# EAGLE design ATmega32 breakout board (EAGLE 6.4)
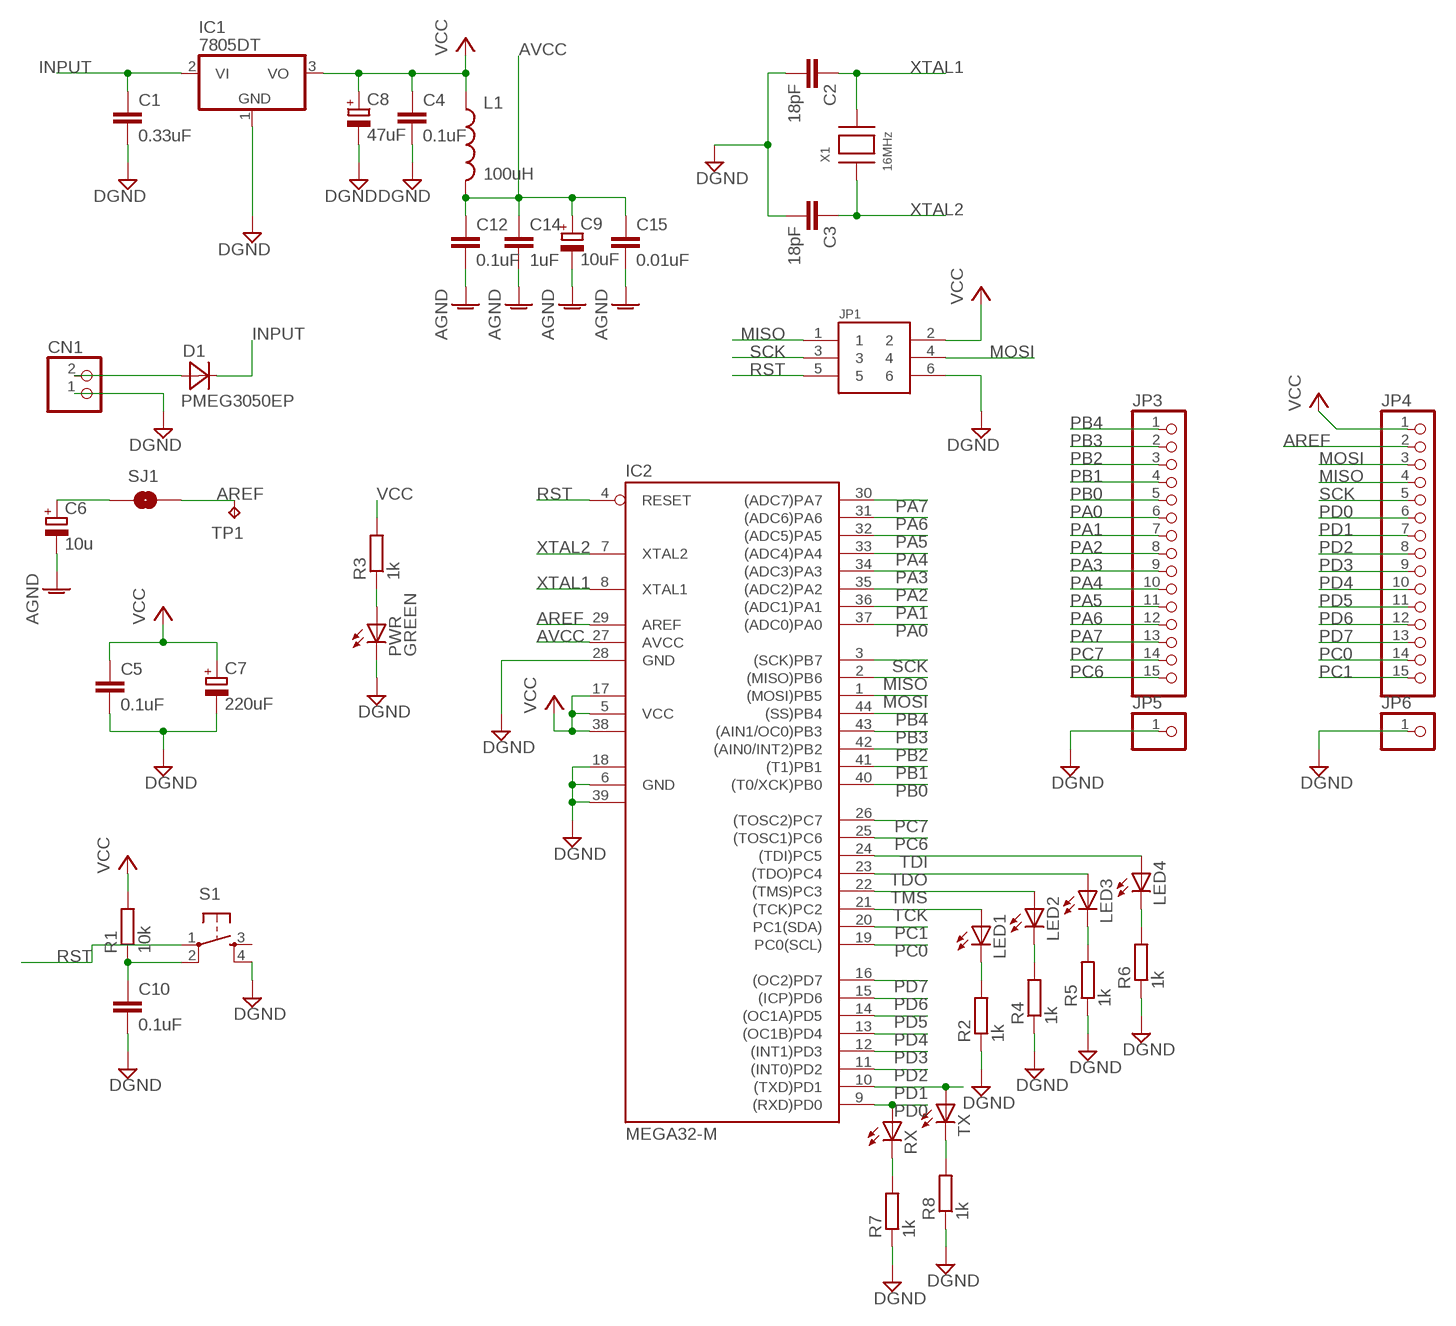
[diagram p0: schematic, sheet 1]

## Parts
C1  0.33uF  C-EUC0603  [C0603]
C2  18pF  C-EUC0603  [C0603]
C3  18pF  C-EUC0603  [C0603]
C4  0.1uF  C-EUC0603  [C0603]
C5  0.1uF  C-EUC0603  [C0603]
C6  10u  CPOL-EUA  [PANASONIC_A]
C7  220uF  CPOL-EUE2.5-5  [E2,5-5]
C8  47uF  CPOL-EUE2.5-5  [E2,5-5]
C9  10uF  CPOL-EUE2-4  [E2-4]
C10  0.1uF  C-EUC0603  [C0603]
C12  0.1uF  C-EUC0603  [C0603]
C14  1uF  C-EUC0603  [C0603]
C15  0.01uF  C-EUC0603  [C0603]
CN1  JST_2PIN-THM-RA  [JST-PH-2-THM-RA]
D1  PMEG3050EP  MBRA340T3  [SMA]
IC1  7805DT  [TO252]
IC2  MEGA32-M  [MLF44]
JP1  M03X2  [2X3-SHROUDED]
JP3  PINHD-1X15-CB  [1X15-CB]
JP4  PINHD-1X15-CB  [1X15-CB]
JP5  PINHD-1X1CB  [1X01-CLEANBIG]
JP6  PINHD-1X1CB  [1X01-CLEANBIG]
L1  100uH  INDUCTOR0805  [0805]
LED1  LEDCHIPLED_0603  [CHIPLED_0603]
LED2  LEDCHIPLED_0603  [CHIPLED_0603]
LED3  LEDCHIPLED_0603  [CHIPLED_0603]
LED4  LEDCHIPLED_0603  [CHIPLED_0603]
PWR  GREEN  LEDCHIPLED_0805  [CHIPLED_0805]
R1  10k  R-EU_R0603  [R0603]
R2  1k  R-EU_R0402  [R0402]
R3  1k  R-EU_R0603  [R0603]
R4  1k  R-EU_R0402  [R0402]
R5  1k  R-EU_R0402  [R0402]
R6  1k  R-EU_R0402  [R0402]
R7  1k  R-EU_R0402  [R0402]
R8  1k  R-EU_R0402  [R0402]
RX  LEDCHIPLED_0603  [CHIPLED_0603]
S1  TAC_SWITCHSMD  [TACTILE_SWITCH_SMD]
SJ1  SOLDERJUMPER-OLDTRACE  [SJ_2S-TRACE]
TP1  TPTP10R  [TP10R]
TX  LEDCHIPLED_0603  [CHIPLED_0603]
X1  16MHz  XTALNX5032  [NX5032]

## Nets
AGND: C6.- C9.- C12.2 C14.2 C15.2
AREF: IC2.29(AREF) JP4.2 SJ1.2 TP1.TP
AVCC: C9.+ C12.1 C14.1 C15.1 IC2.27(AVCC) L1.2
GND: C1.2 C2.2 C3.2 C4.2 C5.2 C7.- C8.- C10.2 CN1.1 IC1.1(GND) IC2.6(GND) IC2.18(GND1) IC2.28(GND) IC2.39(GND2) JP1.6 JP5.1 JP6.1 PWR.C R2.1 R4.1 R5.1 R6.1 R7.1 R8.1 S1.4 ; supply symbol labelled DGND
INPUT: C1.1 D1.C IC1.2(VI)
MISO: IC2.2((MISO)PB6) JP1.1 JP4.4
MOSI: IC2.1((MOSI)PB5) JP1.4 JP4.3
N$1: PWR.A R3.1
N$2: C10.1 R1.1 S1.2
N$3: CN1.2 D1.A
N$4: LED1.C R2.2
N$5: C6.+ SJ1.1
N$6: LED2.C R4.2
N$7: LED3.C R5.2
N$8: LED4.C R6.2
N$9: R7.2 RX.C
N$10: R8.2 TX.C
PA0: IC2.37((ADC0)PA0) JP3.6
PA1: IC2.36((ADC1)PA1) JP3.7
PA2: IC2.35((ADC2)PA2) JP3.8
PA3: IC2.34((ADC3)PA3) JP3.9
PA4: IC2.33((ADC4)PA4) JP3.10
PA5: IC2.32((ADC5)PA5) JP3.11
PA6: IC2.31((ADC6)PA6) JP3.12
PA7: IC2.30((ADC7)PA7) JP3.13
PB0: IC2.40((T0/XCK)PB0) JP3.5
PB1: IC2.41((T1)PB1) JP3.4
PB2: IC2.42((AIN0/INT2)PB2) JP3.3
PB3: IC2.43((AIN1/OC0)PB3) JP3.2
PB4: IC2.44((SS)PB4) JP3.1
PC0: IC2.19(PC0(SCL)) JP4.14
PC1: IC2.20(PC1(SDA)) JP4.15
PC6: IC2.25((TOSC1)PC6) JP3.15
PC7: IC2.26((TOSC2)PC7) JP3.14
PD0: IC2.9((RXD)PD0) JP4.6 RX.A
PD1: IC2.10((TXD)PD1) JP4.7 TX.A
PD2: IC2.11((INT0)PD2) JP4.8
PD3: IC2.12((INT1)PD3) JP4.9
PD4: IC2.13((OC1B)PD4) JP4.10
PD5: IC2.14((OC1A)PD5) JP4.11
PD6: IC2.15((ICP)PD6) JP4.12
PD7: IC2.16((OC2)PD7) JP4.13
RST: IC2.4(RESET) JP1.5 S1.1
SCK: IC2.3((SCK)PB7) JP1.3 JP4.5
TCK: IC2.21((TCK)PC2) LED1.A
TDI: IC2.24((TDI)PC5) LED4.A
TDO: IC2.23((TDO)PC4) LED3.A
TMS: IC2.22((TMS)PC3) LED2.A
VCC: C4.1 C5.1 C7.+ C8.+ IC1.3(VO) IC2.5(VCC) IC2.17(VCC1) IC2.38(VCC2) JP1.2 JP4.1 L1.1 R1.2 R3.2
XTAL1: C2.1 IC2.8(XTAL1) X1.P$2
XTAL2: C3.1 IC2.7(XTAL2) X1.P$1
Unconnected: S1.3

## Library data of the parts
C1-C5 C10 C12 C14 C15 = rcl:C-EU: CAPACITOR, European symbol
C6 C8 C9 = rcl:CPOL-EU: POLARIZED CAPACITOR, European symbol
C7 = resistor:CPOL-EU: POLARIZED CAPACITOR, European symbol
CN1 = adafruit:JST_2PIN: JST 2-Pin Connectors of various flavors SMT-RA (S2B-PH-SM4) 4UConnector #17311 SMT (B2B-PH-SM4) THM-RA (S2B-PH) THM (B2B-PH)
D1 = diode:MBRA340T3: Surface Mount Schottky Power Rectifier Source: http://www.onsemi.com/pub_link/Collateral/MBRA340T3-D.PDF
IC1 = 78L05:78*: Positive VOLTAGE REGULATOR Source: http://cache.national.com/ds/LM/LM78L05.pdf http://www.fairchildsemi.com/ds/LM/LM7805.pdf
IC2 = atmel:MEGA32: MICROCONTROLLER 32 Kbytes FLASH 2 Kbytes SRAM 1 Kbytes EEPROM USART 8-channel 10 bit ADC Source: www.atmel.com .. doc2503.pdf; MPN: ATMEGA32-16MU; OC_FARNELL: 1455108; OC_NEWARK: 58M3733
JP1 = SparkFun-Connectors:M03X2: 2x3 .1" header. Shrouded, with keying- CONN-10681 SMT- ??? (4UCON 15881); PROD_ID: CONN-10681
JP3 JP4 = adafruit:PINHD-1X15: PIN HEADER
JP5 JP6 = adafruit:PINHD-1X1: Pin header 1x1 for 0.1" spacing With round pins
L1 = SparkFun:INDUCTOR: Inductors Basic Inductor/Choke - 0603 and 1206. Footprints are not proven and vary greatly between part numbers.
LED1-LED4 PWR RX TX = adafruit:LED: LED OSRAM: - CHIPLED LG R971, LG N971, LY N971, LG Q971, LY Q971, LO R971, LY R971 LH N974, LH R974 LS Q976, LO Q976, LY Q976 LO Q996 - Hyper CHIPLED LW Q18S LB Q993, LB Q99A, LB R99A - SideLED LS A670, LO A670, LY A670, LG A670, LP A670 LB A673, LV A673, LT A673, LW A673 LH A674 LY A675 LS A676, LA A676, LO A676, LY A676, LW A676 LS A679, LY A679, LG A679 - Hyper Micro SIDELED® LS Y876, LA Y876, LO Y876, LY Y876 LT Y87S - SmartLED LW L88C, LW L88S LB L89C, LB L89S, LG L890 LS L89K, LO L89K, LY L89K LS L896, LA L896, LO L896, LY L896 - TOPLED LS T670, LO T670, LY T670, LG T670, LP T670 LSG T670, LSP T670, LSY T670, LOP T670, LYG T670 LG T671, LOG T671, LSG T671 LB T673, LV T673, LT T673, LW T673 LH T674 LS T676, LA T676, LO T676, LY T676, LB T676, LH T676, LSB T676, LW T676 LB T67C, LV T67C, LT T67C, LS T67K, LO T67K, LY T67K, LW E67C LS E67B, LA E67B, LO E67B, LY E67B, LB E67C, LV E67C, LT E67C LW T67C LS T679, LY T679, LG T679 LS T770, LO T770, LY T770, LG T770, LP T770 LB T773, LV T773, LT T773, LW T773 LH T774 LS E675, LA E675, LY E675, LS T675 LS T776, LA T776, LO T776, LY T776, LB T776 LHGB T686 LT T68C, LB T68C - Hyper Mini TOPLED® LB M676 - Mini TOPLED Santana® LG M470 LS M47K, LO M47K, LY M47K Source: http://www.osram.convergy.de/
R1-R8 = resistor:R-EU_: RESISTOR, European symbol
S1 = SparkFun:TAC_SWITCH: Momentary Switch Button commonly used for reset or general input. Spark Fun Electronics SKU : COM-00097
SJ1 = SparkFun-Passives:SOLDERJUMPER-OLD: Solder Jumper Standard SMD solder jumper. Used to automate production. Two varients : Normally Open and Normally Closed are the same, but have different paste layers. NC will have a large amount of paste and should jumper during reflow.
TP1 = testpad:TP: Test pad
X1 = adafruit:XTAL: Low cost SMT crystals, no capacitors included http://www.ladyada.net/library/eagle

## Net classes
1 vcc: width 0.254 mm

## Board
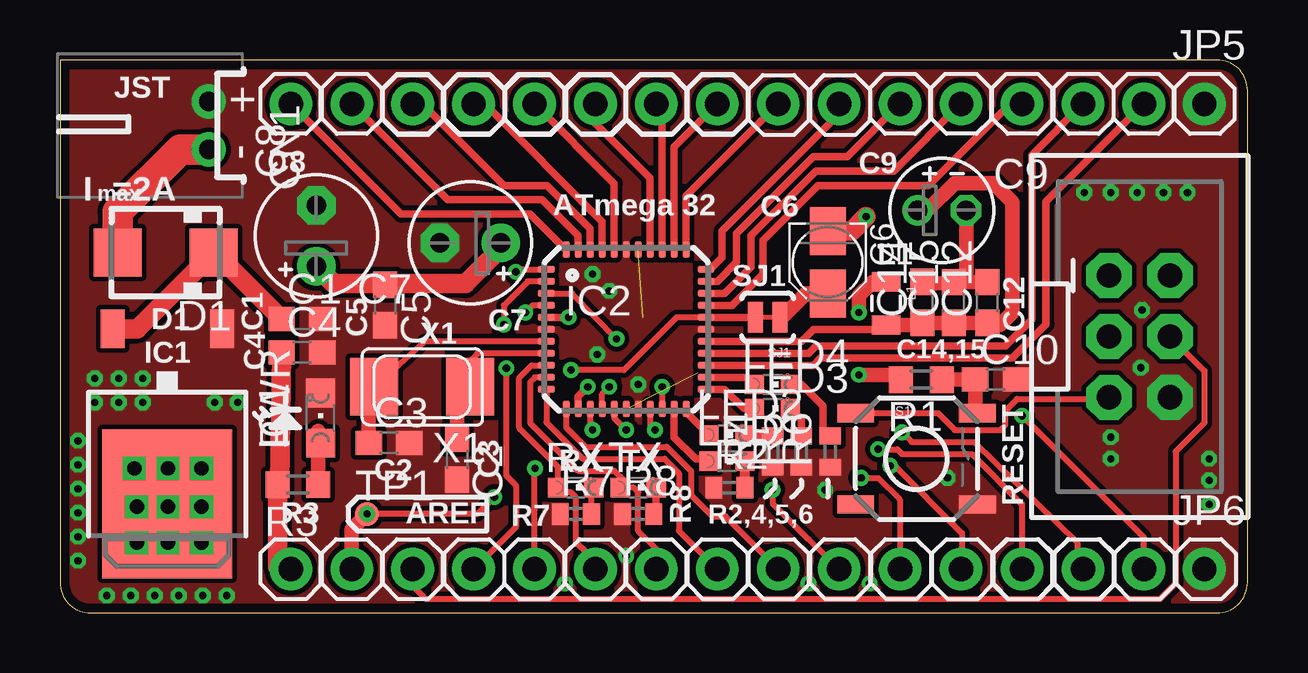
[diagram p1: board, top side]
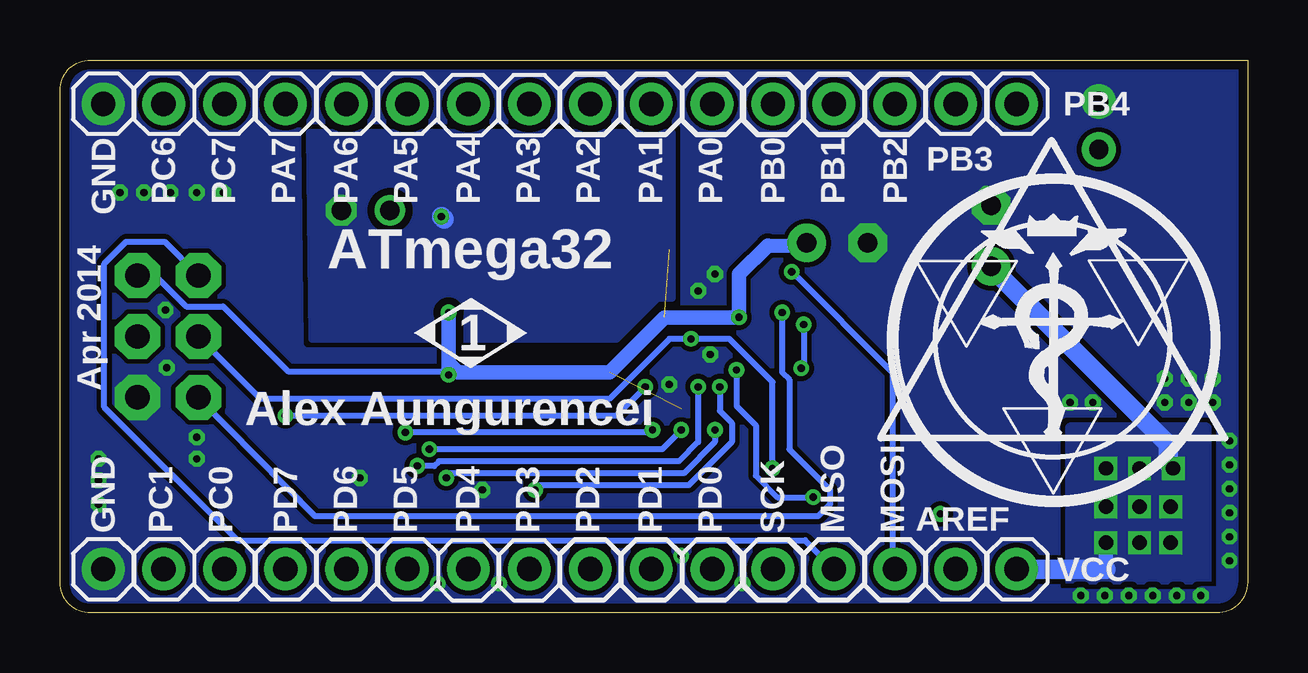
[diagram p2: board, bottom side, seen from below]

Size 49.5 x 23.06 mm. Coordinates in mm from the lower left corner, seen from the top.
Outline: 0,23.06 0,1.27 arc90 1.27,0 48.23,0 arc90 49.5,1.27 49.5,21.79 arc90 48.23,23.06 0,23.06
Copper layers (1*16): Top 0.0356mm / dielectric 1.5011mm / Bottom 0.0356mm
Design rules "default *": minimum track width 6mil, minimum drill 11mil, track to track 6mil, track to pad 6mil, pad to pad 6mil, via to via 6mil, smd to smd 6mil, copper to edge 15mil, drill to drill 6mil, minimum pad ring 7mil, minimum via ring 7mil, stop-mask expansion 4mil, vias tented up to drill 0mil, thermal gap 10mil

### Footprints (pad centres in the part's own frame; a part is rotated, then mirrored left to right if it is on the bottom)
C0603 = smd 1.1 x 1: 1 -0.85,0; 2 0.85,0
PANASONIC_A = smd 2 x 1.5: + 1.3,0; - -1.3,0
E2,5-5 = drill 0.813 pad 1.6: + -1.27,0 | drill 0.813 pad 1.6 octagon: - 1.27,0
E2-4 = drill 0.813 pad 1.27: + -1.016,0 | drill 0.813 pad 1.27 octagon: - 1.016,0
JST-PH-2-THM-RA = drill 0.8 pad 1.422: 1 1,0; 2 -1,0
SMA = smd 2 x 2: A 2,0; C -2,0
TO252 = smd 1 x 1.6: 1 -2.28,-4.8; 2 2.28,-4.8 | smd 5.4 x 6.2: 3 0,2.5
MLF44 = smd 0.7 x 0.3: 1 -3.325,2.5; 2 -3.325,2; 3 -3.325,1.5; 4 -3.325,1; 5 -3.325,0.5; 6 -3.325,0; 7 -3.325,-0.5; 8 -3.325,-1; 9 -3.325,-1.5; 10 -3.325,-2; 11 -3.325,-2.5; 23 3.325,-2.5; 24 3.325,-2; 25 3.325,-1.5; 26 3.325,-1; 27 3.325,-0.5; 28 3.325,0; 29 3.325,0.5; 30 3.325,1; 31 3.325,1.5; 32 3.325,2; 33 3.325,2.5 | smd 0.3 x 0.7: 12 -2.5,-3.325; 13 -2,-3.325; 14 -1.5,-3.325; 15 -1,-3.325; 16 -0.5,-3.325; 17 0,-3.325; 18 0.5,-3.325; 19 1,-3.325; 20 1.5,-3.325; 21 2,-3.325; 22 2.5,-3.325; 34 2.5,3.325; 35 2,3.325; 36 1.5,3.325; 37 1,3.325; 38 0.5,3.325; 39 0,3.325; 40 -0.5,3.325; 41 -1,3.325; 42 -1.5,3.325; 43 -2,3.325; 44 -2.5,3.325
2X3-SHROUDED = drill 1.016 pad 1.88 octagon: 1 -1.27,2.54; 2 1.27,2.54; 3 -1.27,0; 4 1.27,0; 5 -1.27,-2.54; 6 1.27,-2.54
1X15-CB = drill 1.016 pad 1.778: 1 -17.78,0; 2 -15.24,0; 3 -12.7,0; 4 -10.16,0; 5 -7.62,0; 6 -5.08,0; 7 -2.54,0; 8 0,0; 9 2.54,0; 10 5.08,0; 11 7.62,0; 12 10.16,0; 13 12.7,0; 14 15.24,0; 15 17.78,0
1X01-CLEANBIG = drill 1.016 pad 1.778: 1 0,0
0805 = smd 0.8 x 1.2: 1 -0.9,0; 2 0.9,0
CHIPLED_0603 = smd 0.8 x 0.8: A 0,-0.75; C 0,0.75
CHIPLED_0805 = smd 1.2 x 1.2: A 0,-1.05; C 0,1.05
R0603 = smd 1 x 1.1: 1 -0.85,0; 2 0.85,0
R0402 = smd 0.7 x 0.9: 1 -0.65,0; 2 0.65,0
TACTILE_SWITCH_SMD = smd 1.524 x 0.762: 1 -2.54,1.905; 2 2.54,1.905; 3 -2.54,-1.905; 4 2.54,-1.905
SJ_2S-TRACE = smd 0.635 x 1.27: 1 -0.508,0; 2 0.508,0
TP10R = smd 1 x 1: TP 0,0
NX5032 = smd 2 x 2.4: P$1 2,0; P$2 -2,0

### Placement (x,y rotation side)
C1  10.09,12.25 0 top
C2  16.55,6.41 270 top
C3  13.72,7.1 0 top
C4  10.09,10.87 0 top
C5  13.56,12.84 270 top
C6  32,14.63 270 top
C7  17.1,15.43 180 top
C8  10.68,15.72 90 top
C9  36.76,16.79 0 top
C10  39,9.73 0 top
C12  38.65,12.95 90 top
C14  35.95,12.96 90 top
C15  37.26,12.95 90 top
CN1  6.2,20.33 90 top
D1  4.4,15.03 180 top
IC1  4.47,7.05 180 top
IC2  23.6,11.83 0 top
JP1  45,11.53 0 top
JP3  27.4,21.23 0 top
JP4  27.4,1.83 0 top
JP5  47.7,21.23 0 top
JP6  47.7,1.83 0 top
L1  34.44,12.91 270 top
LED1  27.8,6.33 270 top
LED2  27.8,7.43 270 top
LED3  29.7,8.53 270 top
LED4  29.7,9.53 270 top
PWR  10.86,8.13 0 top
R1  35.9,9.73 180 top
R2  [R0402]  27.9,5.23 0 top
R3  9.92,5.36 180 top
R4  [R0402]  29.7,6.73 90 top
R5  [R0402]  30.9,6.73 90 top
R6  [R0402]  32.1,6.73 90 top
R7  [R0402]  21.5,4.13 0 top
R8  [R0402]  24.1,4.13 0 top
RX  21.5,5.23 270 top
S1  35.7,6.43 0 top
SJ1  29.5,12.33 180 top
TP1  12.8,4.13 0 top
TX  24.1,5.23 270 top
X1  15.1,9.43 180 top

### Tracks (layer width: path | path; a pad name or v marks a point on that pad's centre or on a via)
AGND  (via drill 0.3)
  Top 0.61: C9.- 37.78,14.22 C15.2 | C12.2 C15.2 | C15.2 35.96,13.7 C14.2
  Top 0.813: C6.- 33,15.93 v33.6,16.53
  Bottom 0.813: v33.6,16.53 33.5,16.43
  pour Bottom (isolate 0.3, rank 4, no thermals): 24,20.03 24,13.13 24.6,13.13 26.3,11.43 39,11.43 39.1,20.03
AREF  (via drill 0.3)
  Top 0.254: IC2.29 25.7,12.33 23.5,10.13 v21.3,10.13 | v18.1,4.83 17.4,4.13 TP1.TP
  Top 0.305: IC2.29 SJ1.2
  Top 0.61: JP4.2 12.16,3.49 TP1.TP
  Bottom 0.254: v21.3,10.13 21.3,8.63 20.5,7.83 20.5,5.73 19.6,4.83 v18.1,4.83
  other vias: 12.8,4.13
AVCC
  Top 0.305: IC2.27 30.9,11.33 31.4,11.83 33.86,11.83 L1.2
  Top 0.61: C9.+ 36.16,16.79 37.3,17.93 38.9,17.93 39.7,17.13 39.7,12.53 39.17,12 C12.1 C15.1 C14.1 35.85,12.01 L1.2
GND  (via drill 0.3)
  other vias: 31.9,5.13 37,5.63 43.8,7.33 43.8,6.43 47.9,4.53 47.9,5.53 47.9,6.43 42.7,17.53 43.8,17.53 44.9,17.53 46,17.53 47,17.53 22.9,13.43 22.2,14.13 24.1,9.53 22.4,10.78 23.6,2.38 31.2,1.23 33.75,1.23 45.05,10.23 45.1,12.63 7.4,8.78 6.45,8.78 3.45,8.78 2.45,8.78 1.45,8.78 3.45,9.78 2.45,9.78 1.45,9.78 1.95,0.73 2.95,0.73 3.95,0.73 4.95,0.73 5.95,0.73 6.95,0.73 0.75,2.18 0.75,3.18 0.75,4.18 0.75,5.18 0.75,6.18 0.75,7.18 21.05,1.23
  pour Bottom (isolate 0.2, rank 6, no thermals): -0.6,24.83 -0.6,-0.87 50.6,-0.87 50.6,24.83
  pour Top (isolate 0.2, rank 6, no thermals): -1.7,25.33 51.7,25.93 52.3,-1.77 -1.3,-1.77 -1.5,22.23
INPUT
  Top 0.61: D1.C 6.46,15.03
  Top 0.813: IC1.2 3.22,11.85 D1.C | 6.46,15.03 C1.1
MISO  (via drill 0.3)
  Top 0.254: IC2.2 19.5,13.83 18.5,12.83 v18.5,12.03 | v18.6,10.21 18.6,5.73 19,5.33 19,3.59 JP4.4
  Bottom 0.254: v18.5,12.03 18.5,10.33 v18.6,10.21 | JP4.4 18.44,3.03 42.1,3.03 47.65,8.58 47.65,14.58 46.75,15.48 45.14,15.48 JP1.1
MOSI  (via drill 0.3)
  Top 0.254: v19,14.23 19.3,14.33 IC2.1 | JP1.4 47.7,10.1 47.7,7.93 46.5,6.73 46.5,1.23 45.85,0.58 15.25,0.58 14.7,1.13 JP4.3
  Bottom 0.254: v19,14.23 14.8,10.03 14.8,1.93 JP4.3
N$1
  Top 0.61: R3.1 10.77,7.59 PWR.A
N$2
  Top 0.61: S1.2 38.15,8.52 C10.1 R1.1
N$3
  Top 1.27: CN1.2 5,19.33 2.4,16.73 D1.A
N$4
  Top 0.406: R2.2 LED1.C
N$5
  Top 0.61: SJ1.1 30.1,12.33 31.1,13.33 C6.+
N$6
  Top 0.406: R4.2 29.65,7.28 29.5,7.33 28.65,7.33 LED2.C
N$7
  Top 0.305: R5.2 30.9,8.08 LED3.C
N$8
  Top 0.305: LED4.C 30.9,9.53 31.8,8.63 31.8,7.48 R6.2
N$9
  Top 0.254: R7.2 22.15,5.13 RX.C
N$10
  Top 0.305: TX.C 24.85,4.23 R8.2
PA0
  Top 0.305: IC2.37 24.6,18.13 22.3,20.43 22.3,21.21 JP3.6
PA1
  Top 0.305: IC2.36 25.1,20.99 JP3.7
PA2
  Top 0.305: IC2.35 25.6,19.43 JP3.8
PA3
  Top 0.305: IC2.34 26.1,17.39 JP3.9
PA4
  Top 0.305: IC2.33 27.1,14.33 27.6,14.83 27.6,15.93 32.2,20.53 32.5,20.53 32.5,21.25 JP3.10
PA5
  Top 0.305: IC2.32 27.4,13.83 28.2,14.63 28.2,15.83 31.4,19.03 32.82,19.03 JP3.11
PA6
  Top 0.305: IC2.31 27.7,13.33 28.8,14.43 28.8,15.73 31.5,18.43 34.76,18.43 JP3.12
PA7
  Top 0.305: IC2.30 28,12.83 29.3,14.13 29.3,15.53 31.6,17.83 36.2,17.83 39.4,21.03 39.9,21.03 JP3.13
PB0
  Top 0.305: IC2.40 23.1,17.91 JP3.5
PB1
  Top 0.305: JP3.4 17.7,21.23 22.6,16.33 IC2.41
PB2
  Top 0.305: JP3.3 15.1,21.23 18.5,17.83 20.3,17.83 22.1,16.03 IC2.42
PB3
  Top 0.305: JP3.2 16.16,17.23 20.1,17.23 21.6,15.73 IC2.43
PB4
  Top 0.305: IC2.44 21.07,15.15 19.6,16.63 14.22,16.63 JP3.1
PC0  (via drill 0.3)
  Top 0.254: IC2.19 24.6,7.73 v24.8,7.63 | v35.1,7.53 35.5,7.13 38.1,7.13 42.4,2.93 42.4,2.07 JP4.14
  Top 0.305: 42.7,1.89 JP4.14
  Bottom 0.254: v24.8,7.63 24.9,7.53 v35.1,7.53
PC1  (via drill 0.3)
  Top 0.254: v25.1,9.43 IC2.20 | JP4.15 45.18,3.15 v40.1,8.23
  Bottom 0.254: v40.1,8.23 26.3,8.23 v25.1,9.43
PC6
  Top 0.305: IC2.25 31.4,10.33 31.7,10.63 39.7,10.63 41.1,12.03 41.1,17.15 JP3.15
PC7
  Top 0.305: JP3.14 40.5,19.09 40.5,12.23 39.4,11.13 31.5,11.13 31.2,10.83 IC2.26
PD0
  Top 0.254: JP4.6 22.32,2.21 21.5,2.93 21.5,4.83 21.3,5.03 20.95,5.03 RX.A 20.75,6.1 19.14,7.71 19.14,9.81 19.66,10.33 IC2.9
PD1
  Top 0.254: JP4.7 24.86,2.67 24.1,3.43 24.1,5.03 23.9,5.23 TX.A 23.5,5.08 23.5,5.53 23.1,5.93 21.6,5.93 19.6,7.93 19.6,9.63 19.8,9.83 IC2.10
PD2
  Top 0.254: IC2.11 20.27,7.96 21.8,6.43 25.2,6.43 25.8,5.83 25.8,3.43 JP4.8
PD3
  Top 0.254: IC2.12 21.1,7.73 21.9,6.93 25.3,6.93 26.3,5.93 26.3,4.93 27.2,4.03 27.74,4.03 JP4.9
PD4  (via drill 0.3)
  Top 0.254: v29.7,5.13 29.7,4.58 31.2,3.08 32.4,1.91 JP4.10
  Top 0.305: IC2.13 21.6,9.03 v22,9.43
  Bottom 0.254: v22,9.43 22,8.43 21.5,7.93 21.5,7.13 23.3,5.33 29.5,5.33 v29.7,5.13
PD5  (via drill 0.3)
  Top 0.254: IC2.14 22.1,7.73 v22.2,7.63 | v33.4,5.63 34.1,5.63 35,4.73 35,1.85 JP4.11
  Bottom 0.254: v22.2,7.63 22.2,7.13 23.5,5.83 33.2,5.83 v33.4,5.63
PD6  (via drill 0.3)
  Top 0.254: IC2.15 22.6,9.13 v22.9,9.43 | 34.7,6.23 37.6,3.33 37.6,1.87
  Top 0.305: v34.6,6.13 34.7,6.23 | 37.6,1.87 JP4.12
  Bottom 0.254: 22.9,9.33 22.9,7.13 23.7,6.33 33.7,6.33 33.9,6.13 v34.6,6.13
  Bottom 0.305: v22.9,9.43 22.9,9.33
PD7  (via drill 0.3)
  Top 0.254: IC2.16 23.1,8.13 v23.6,7.63 | v34.1,6.83 34.9,6.83 35.1,6.63 38,6.63 40.1,4.53 JP4.13
  Bottom 0.254: v23.6,7.63 24.4,6.83 v34.1,6.83
RST  (via drill 0.3)
  Top 0.254: S1.1 36.59,8.33 37.3,7.63 39.2,7.63 39.4,7.83 39.4,8.43 39.9,8.93 43.59,8.93 JP1.5 | IC2.4 19.7,12.83 v19.4,12.53
  Bottom 0.254: v19.4,12.53 19.4,10.03 19.1,9.73 19.1,6.83 17.4,5.13 17.4,4.53 17.9,4.03 38.87,4.03 JP1.5
SCK  (via drill 0.3)
  Top 0.254: IC2.3 21.35,13.33 v23.2,11.43 | JP4.5 19.78,6.01 v19.8,6.03
  Bottom 0.254: JP1.3 41.13,8.93 26.6,8.93 24.1,11.43 v23.2,11.43 21.6,11.43 19.8,9.63 v19.8,6.03
TCK
  Top 0.305: IC2.21 25.6,7.33 26.5,6.43 26.95,6.43 LED1.A
TDI
  Top 0.305: IC2.24 28.65,9.83 LED4.A
TDO
  Top 0.305: LED3.A 28.5,8.53 27.7,9.33 IC2.23
TMS
  Top 0.305: IC2.22 26.1,8.38 LED2.A
VCC  (via drill 0.3, 0.6)  (2 unrouted)
  Top 0.2: v4.5,4.43 4.5,4.52 IC1.3
  Top 0.254: C5.1 12.84,13.69 12.8,13.73
  Top 0.305: IC2.5 v21.2,12.33
  Top 0.61: JP4.1 9.07,1.93 | R3.2 9.16,5.36 | R1.2 35,9.73 35,9.93 v33.3,9.93 | v33.3,12.53 33.3,13.23 33.9,13.83 34.42,13.83 L1.1 34.5,13.87
  Top 0.813: 9.07,1.93 R3.2 | 9.16,5.36 C4.1 | C7.+ 18.37,15.2 16.9,13.73 12.8,13.73 11.4,13.73 C8.+
  Bottom 0.254: JP1.2 45.54,14.07 44.25,12.78 42.7,12.78 40,10.08 32.85,10.08 32.8,10.03
  Bottom 0.305: 18.4,15.3 C7.+
  Bottom 0.61: 5.9,1.83 v5.9,2.93 | 18.4,15.3 20,15.33 21.2,14.13 v21.2,12.33 24.3,12.33 26.6,10.03 32.8,10.03 32.9,10.03 | 32.9,10.03 33.3,10.33 v33.3,9.93 | v33.3,12.53 33.3,10.43 32.9,10.03
  Bottom 0.813: JP4.1 5.9,1.83 | C8.+ 10.68,14.41 3.3,7.03 3.3,6.23 v3.1,6.03
  other vias: 4.5,6.03 5.9,6.03 3.2,4.43 5.9,4.43 3.2,2.93 4.5,2.93
  pour Bottom (isolate 0.254, rank 5, no thermals): 1.7,7.73 7.4,7.73 7.4,1.33 1.7,1.33 1.7,7.23
XTAL1
  Top 0.254: IC2.8 17.4,10.83 16.8,10.23 X1.P$2
  Top 0.61: C2.1 16.53,9.3 X1.P$2
XTAL2
  Top 0.254: IC2.7 15.2,11.33 X1.P$1
  Top 0.61: C3.1 12.87,9.1 X1.P$1

### Text on the board
_tsilk: JST | C8 | C9 | I =2A | max | ATmega 32 | C6 | L1 | SJ1 | C5 | D1 | C1 | C7 | C12 | X1 | C14,15 | IC1 | C4 | C2 | C3 | RX | TX | R3 | AREF | R7 | R8 | R2,4,5,6 | RESET
_bsilk: PB4 | PB2 | PB1 | PB0 | PA0 | PA1 | PA2 | PA3 | PA4 | PA5 | PA6 | PA7 | PC7 | PC6 | GND | PB3 | Apr 2014 | ATmega32 | 1 | Alex Aungurencei | AREF | MOSI | MISO | SCK | PD0 | PD1 | PD2 | PD3 | PD4 | PD5 | PD6 | PD7 | PC0 | PC1 | GND | VCC